# EAGLE design working (EAGLE 6.5.0)
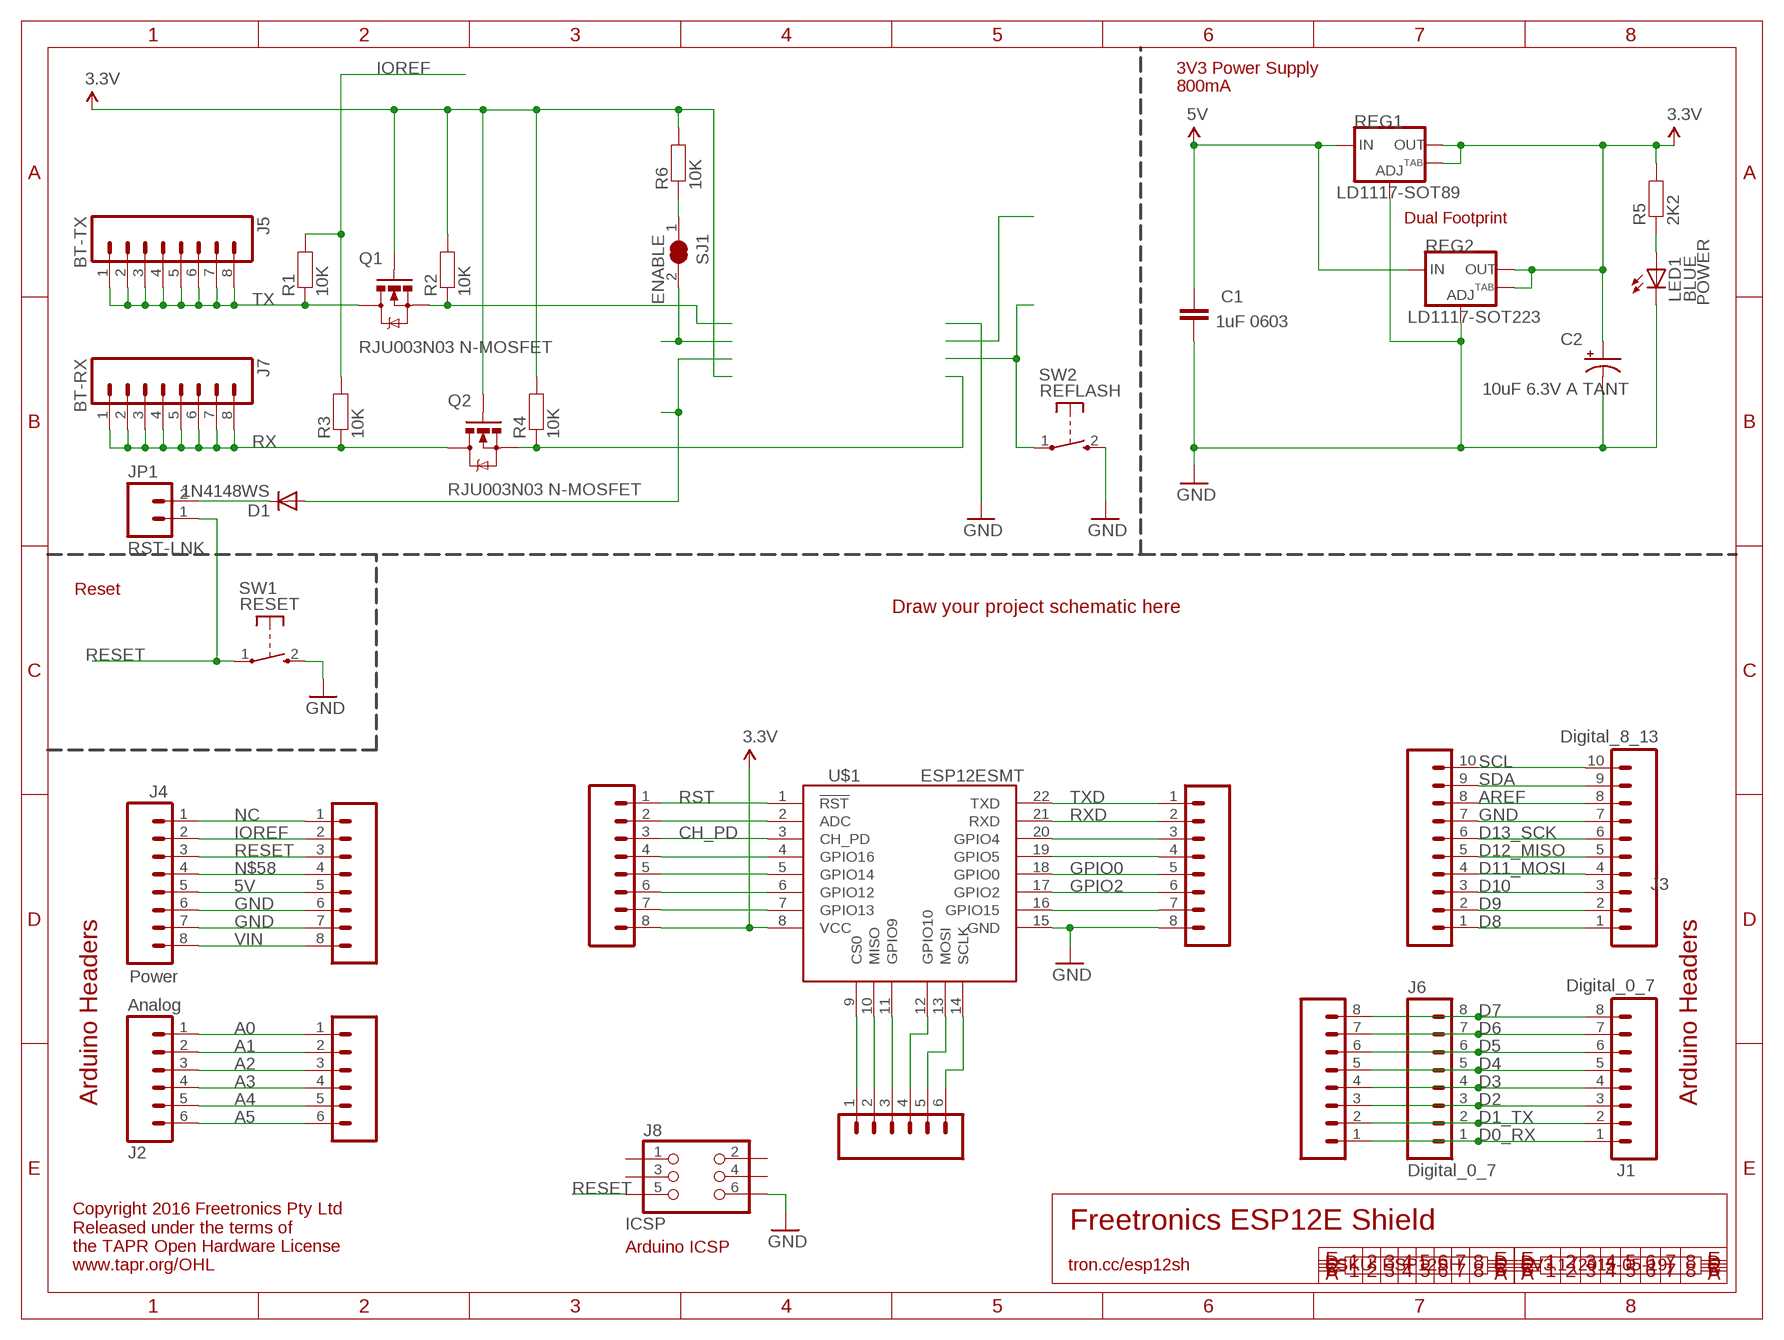
[diagram p0: schematic, sheet 1]

## Parts
C1  1uF 0603  CAP0603  [0603]
C2  10uF 6.3V A TANT  CAP_POL1206  [EIA3216]
D1  1N4148WS  DIODESOD  [SOD-323]
J1  Digital_0_7  M08  [1X08]
J2  Analog  M06SIP  [1X06]
J3  Digital_8_13  M100.1  [1X10]
J4  Power  M08  [1X08]
J5  BT-TX  M08  [1X08]
J6  Digital_0_7  M08  [1X08]
J7  BT-RX  M08  [1X08]
J8  ICSP  ICSPPTH  [2X03PTH]
JP1  RST-LNK  M02PTH  [1X02]
LED1  BLUE  LED0603  [LED-0603]
Q1  RJU003N03 N-MOSFET  MOSFET-NSOT-323  [SOT32-3]
Q2  RJU003N03 N-MOSFET  MOSFET-NSOT-323  [SOT32-3]
R1  10K  RESISTOR0603  [0603]
R2  10K  RESISTOR0603  [0603]
R3  10K  RESISTOR0603  [0603]
R4  10K  RESISTOR0603  [0603]
R5  2K2  RESISTOR0603  [0603]
R6  10K  RESISTOR0603  [0603]
REG1  LD1117-SOT89  V_REG_LM1117SOT89  [SOT89]
REG2  LD1117-SOT223  V_REG_LM1117SOT223  [SOT223]
SJ1  ENABLE  SJCN  [SJC]
SL1  Digital_0_7  M08  [1X08]
SL2  Analog  M06SIP  [1X06]
SL3  Digital_8_13  M100.1  [1X10]
SL4  Power  M08  [1X08]
SL5  5V  M08  [1X08]
SL6  5V  M08  [1X08]
SL7  Analog  M06SIP  [1X06]
SW1  RESET  TAC_SWITCH_2PIN  [TACTILE_SWITCH_SMD_2PIN_TINY]
SW2  REFLASH  TAC_SWITCH_2PIN  [TACTILE_SWITCH_SMD_2PIN_TINY]
U$1  ESP12ESMT  [ESP12E]

## Nets
3.3V: C2.A(+) Q1.1(G) Q2.1(G) R2.2 R4.2 R5.2 R6.2 REG1.2(OUT) REG1.4(OUT) REG2.2(OUT) REG2.4(OUT) SL6.8 U$1.8(VCC)
5V: C1.1 J4.5 REG1.3(IN) REG2.3(IN) SL4.5
A0: J2.1 SL2.1
A1: J2.2 SL2.2
A2: J2.3 SL2.3
A3: J2.4 SL2.4
A4: J2.5 SL2.5
A5: J2.6 SL2.6
AREF: J3.8 SL3.8
CH_PD: SJ1.2 SL6.3 U$1.3(CH_PD)
D0_RX: J1.1 J6.1 SL1.1
D1_TX: J1.2 J6.2 SL1.2
D2: J1.3 J6.3 SL1.3
D3: J1.4 J6.4 SL1.4
D4: J1.5 J6.5 SL1.5
D5: J1.6 J6.6 SL1.6
D6: J1.7 J6.7 SL1.7
D7: J1.8 J6.8 SL1.8
D8: J3.1 SL3.1
D9: J3.2 SL3.2
D10: J3.3 SL3.3
D11_MOSI: J3.4 SL3.4
D12_MISO: J3.5 SL3.5
D13_SCK: J3.6 SL3.6
GND: C1.2 C2.C(-) J3.7 J4.6 J4.7 J8.6 LED1.C REG1.1(ADJ) REG2.1(ADJ) SL3.7 SL4.6 SL4.7 SL5.8 SW1.2(S) SW2.2(S) U$1.15(GND)
GPIO0: SL5.5 SW2.1(P) U$1.18(GPIO0)
GPIO2: SL5.6 U$1.17(GPIO2)
IOREF: J4.2 R1.2 R3.2 SL4.2
N$1: SL7.1 U$1.9(CS0)
N$2: SL7.2 U$1.10(MISO)
N$3: SL7.3 U$1.11(GPIO9)
N$4: SL7.4 U$1.12(GPIO10)
N$14: LED1.A R5.1
N$15: SL7.5 U$1.13(MOSI)
N$16: SL7.6 U$1.14(SCLK)
N$18: SL5.7 U$1.16(GPIO15)
N$19: SL5.4 U$1.19(GPIO5)
N$20: SL5.3 U$1.20(GPIO4)
N$25: SL6.2 U$1.2(ADC)
N$26: SL6.4 U$1.4(GPIO16)
N$27: SL6.5 U$1.5(GPIO14)
N$28: SL6.6 U$1.6(GPIO12)
N$29: SL6.7 U$1.7(GPIO13)
N$58: J4.4 SL4.4
N$60: R6.1 SJ1.1
N$61: D1.1(C) JP1.2
NC: J4.1 SL4.1
RESET: J4.3 J8.5 JP1.1 SL4.3 SW1.1(P)
RST: D1.2(A) SL6.1 U$1.1(!RST)
RX: J7.1 J7.2 J7.3 J7.4 J7.5 J7.6 J7.7 J7.8 Q2.3(D) R3.1
RXD: Q2.2(S) R4.1 SL5.2 U$1.21(RXD)
SCL: J3.10 SL3.10
SDA: J3.9 SL3.9
TX: J5.1 J5.2 J5.3 J5.4 J5.5 J5.6 J5.7 J5.8 Q1.3(D) R1.1
TXD: Q1.2(S) R2.1 SL5.1 U$1.22(TXD)
VIN: J4.8 SL4.8
Unconnected: J8.1 J8.2 J8.3 J8.4

## Notes on the sheet
- 3V3 Power Supply
- 800mA
- Dual Footprint
- POWER
- Reset
- Draw your project schematic here
- Arduino Headers | Arduino Headers
- Freetronics ESP12E Shield
- Arduino ICSP
- Copyright 2016 Freetronics Pty Ltd
  Released under the terms of
  the TAPR Open Hardware License
  www.tapr.org/OHL
- tron.cc/esp12sh | SKU: ESP12SH | V3.1 (2015-05-19)

## Library data of the parts
C1 = freetronics:CAP: Capacitor Standard 0603 ceramic capacitor, and 0.1" leaded capacitor.
C2 = freetronics:CAP_POL: Capacitor Polarized These are standard SMD and PTH capacitors. Normally 10uF, 47uF, and 100uF in electrolytic and tantalum varieties. Always verify the external diameter of the through hole cap, it varies with capacity, voltage, and manufacturer. The EIA devices should be standard.
D1 = freetronics-original:DIODE: Diode These are standard reverse protection diodes and small signal diodes. SMA package can handle up to about 1A. SOD-323 can handle about 200mA. What the SOD-323 package when ordering, there are some mfgs out there that are 5-pin packages.
J1 J4 SL1 SL4-SL6 = freetronics:M08: Header 8 Standard 8-pin 0.1" header. Use with straight break away headers (SKU : PRT-00116), right angle break away headers (PRT-00553), swiss pins (PRT-00743), machine pins (PRT-00117), and female headers (PRT-00115).
J2 SL2 SL7 = freetronics:M06: Header 6 Standard 6-pin 0.1" header. Use with straight break away headers (SKU : PRT-00116), right angle break away headers (PRT-00553), swiss pins (PRT-00743), machine pins (PRT-00117), and female headers (PRT-00115). Molex polarized connector foot print use with SKU : PRT-08094 with associated crimp pins and housings. NOTES ON THE VARIANTS LOCK and LOCK_LONGPADS... This footprint was designed to help hold the alignment of a through-hole component (i.e. 6-pin header) while soldering it into place. You may notice that each hole has been shifted either up or down by 0.005 of an inch from it's more standard position (which is a perfectly straight line). This slight alteration caused the pins (the squares in the middle) to touch the edges of the holes. Because they are alternating, it causes a "brace" to hold the component in place. 0.005 has proven to be the perfect amount of "off-center" position when using our standard breakaway headers. Although looks a little odd when you look at the bare footprint, once you have a header in there, the alteration is very hard to notice. Also, if you push a header all the way into place, it is covered up entirely on the bottom side. This idea of altering the position of holes to aid alignment will be further integrated into the Sparkfun Library for other footprints. It can help hold any component with 3 or more connection pins.
J3 SL3 = freetronics-original:M10: Header 10 Standard 10-pin 0.1" header. Use with straight break away headers (SKU : PRT-00116), right angle break away headers (PRT-00553), swiss pins (PRT-00743), machine pins (PRT-00117), and female headers (PRT-00115).
J5-J7 = freetronics-original:M08: Header 8 Standard 8-pin 0.1" header. Use with straight break away headers (SKU : PRT-00116), right angle break away headers (PRT-00553), swiss pins (PRT-00743), machine pins (PRT-00117), and female headers (PRT-00115).
J8 = freetronics-jon:ICSP
JP1 = freetronics-original:M02: Header 2 Standard 2-pin 0.1" header. Use with straight break away headers (SKU : PRT-00116), right angle break away headers (PRT-00553), swiss pins (PRT-00743), machine pins (PRT-00117), and female headers (PRT-00115). Molex polarized connector foot print use with SKU : PRT-08233 with associated crimp pins and housings.
LED1 = freetronics-jon:LED: LEDs Standard schematic elements and footprints for 5mm, 3mm, 1206, and 0603 sized LEDs. 5mm - Spark Fun Electronics SKU : COM-00529 (and others)
Q1 Q2 = freetronics-jon:MOSFET-N: Basic N-Channel MOSFET
R1-R6 = freetronics-jon:RESISTOR: Resistor Basic schematic elements and footprints for 0603, 1206, and PTH 1/10th watt (small) resistors.
REG1 REG2 = freetronics:V_REG_LM1117: Voltage Regulator LD1117 Adjustable low-dropout voltage regulator available in SOT89 and SOT223 SMT packages.
SJ1 = freetronics-jon:SJC
SW1 SW2 = freetronics-jon:TAC_SWITCH_2PIN: Momentary Tactile Switch - 2 pin
U$1 = freetronics-jon:ESP12E

## Board
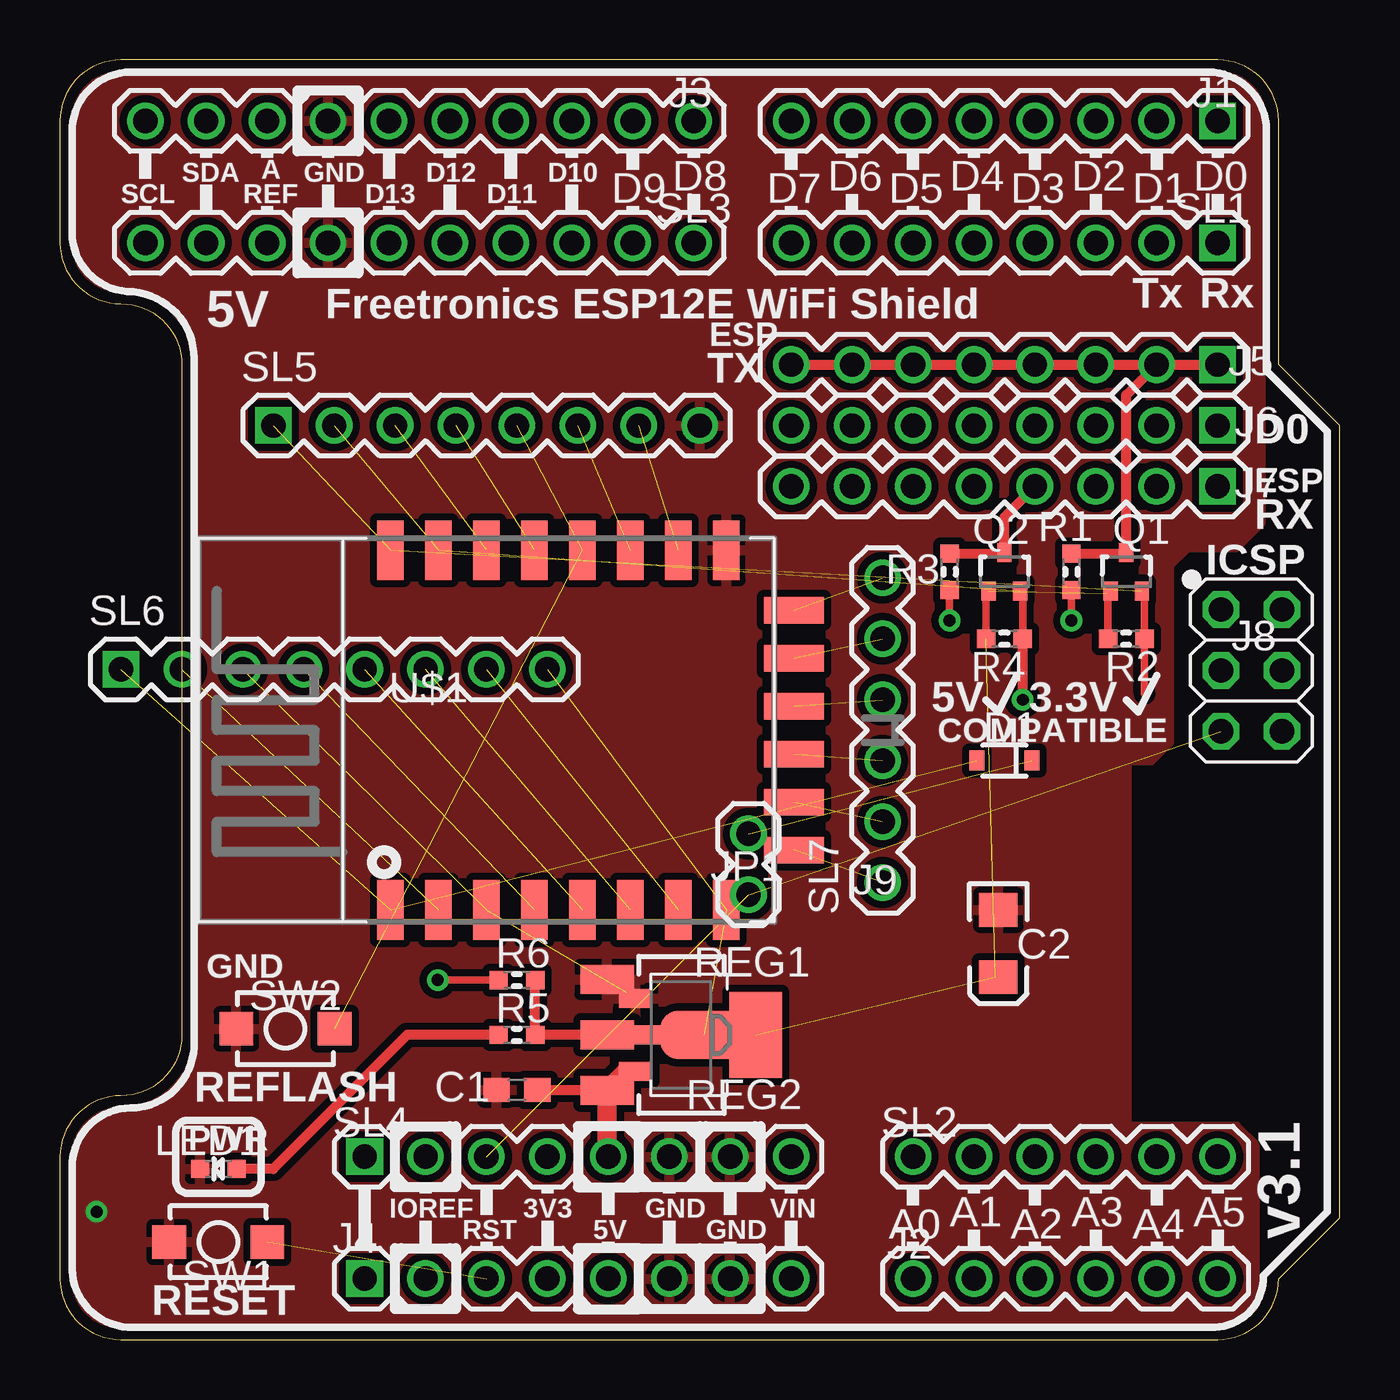
[diagram p1: board, top side]
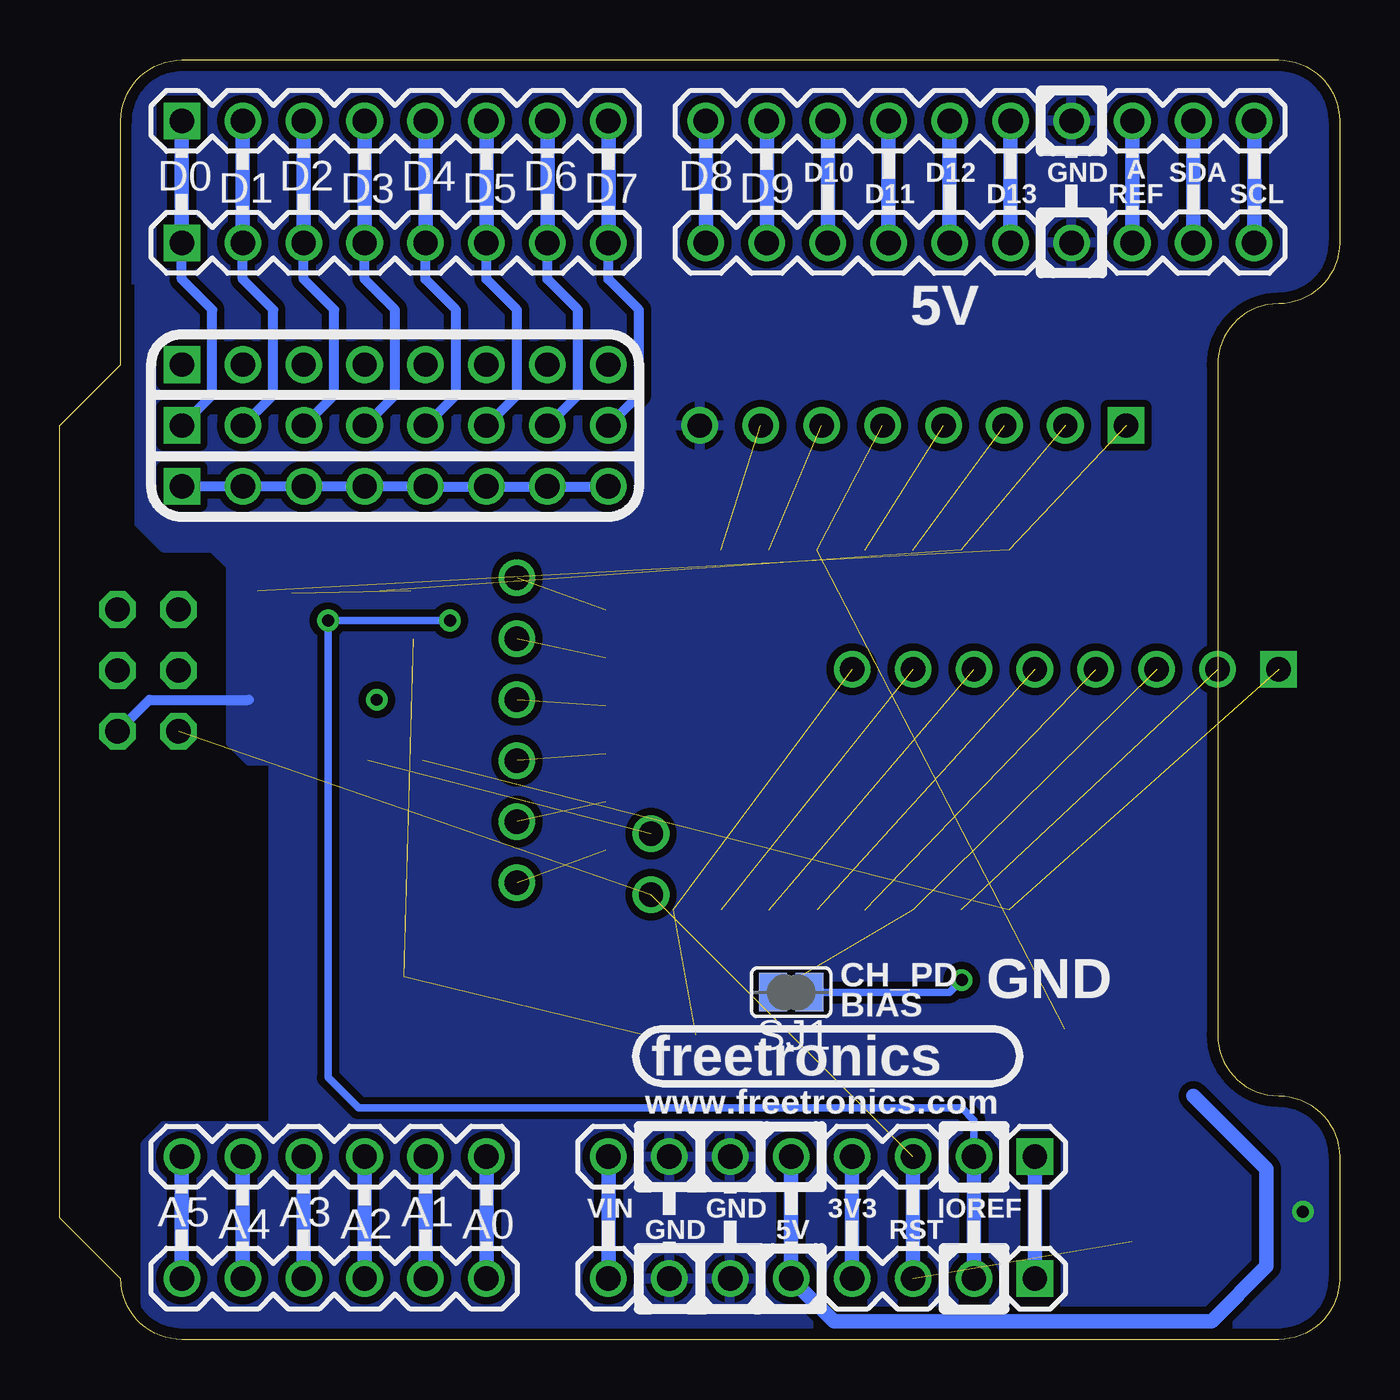
[diagram p2: board, bottom side, seen from below]

Size 53.34 x 53.34 mm. Coordinates in mm from the lower left corner, seen from the top.
Outline: 0,2.54 arc90 2.54,0 48.26,0 arc90 50.8,2.54 53.34,5.08 53.34,38.1 50.8,40.64 50.8,50.8 arc90 48.26,53.34 2.54,53.34 arc90 0,50.8 0,45.72 arc90 2.54,43.18 arc-90 5.08,40.64 5.08,12.7 arc-90 2.54,10.16 arc90 0,7.62 0,2.54
Copper layers (1*16): Top 0.035mm / dielectric 1.5mm / Bottom 0.035mm
Design rules "default *": minimum track width 10mil, minimum drill 24mil, track to track 12mil, track to pad 12mil, pad to pad 12mil, via to via 12mil, smd to smd 8mil, copper to edge 18mil, drill to drill 8mil, minimum pad ring 10mil, minimum via ring 8mil, stop-mask expansion 4mil, vias tented up to drill 20mil, thermal gap 10mil

### Footprints (pad centres in the part's own frame; a part is rotated, then mirrored left to right if it is on the bottom)
0603 = smd 1.1 x 1: 1 -0.85,0; 2 0.85,0
EIA3216 = smd 1.4 x 1.6: A 1.4,0; C -1.4,0
SOD-323 = smd 0.63 x 0.83: 1 -1.15,0; 2 1.15,0
1X08 = drill 1.016 square: 1 0,0 | drill 1.016: 2 2.54,0; 3 5.08,0; 4 7.62,0; 5 10.16,0; 6 12.7,0; 7 15.24,0; 8 17.78,0
1X06 = drill 1.016: 1 0,0; 2 2.54,0; 3 5.08,0; 4 7.62,0; 5 10.16,0; 6 12.7,0
1X10 = drill 1.016: 1 0,0; 2 2.54,0; 3 5.08,0; 4 7.62,0; 5 10.16,0; 6 12.7,0; 7 15.24,0; 8 17.78,0; 9 20.32,0; 10 22.86,0
2X03PTH = drill 1.016 octagon: 1 -2.54,-1.27; 2 -2.54,1.27; 3 0,-1.27; 4 0,1.27; 5 2.54,-1.27; 6 2.54,1.27
1X02 = drill 1.016: 1 0,0; 2 2.54,0
LED-0603 = smd 0.762 x 0.762: A -0.762,0; C 0.762,0
SOT32-3 = smd 0.6 x 0.8: 1 -0.65,-0.8; 2 0.65,-0.8; 3 0,0.8
0603' = smd 0.762 x 0.762: 1 -0.762,0; 2 0.762,0
SOT89 = smd 0.8 x 1.4: 1 -1.524,-1.905; 3 1.524,-1.905 | smd 0.8 x 1.9: 2 0,-1.651 | smd 2.032 x 3.65: 4 0,0.94
SOT223 = smd 1.219 x 2.235: 1 -2.311,-3.099; 2 0,-3.099; 3 2.311,-3.099 | smd 3.6 x 2.2: 4 0,3.099
SJC = smd 1.168 x 1.6: 1 -0.762,0; 2 0.762,0
TACTILE_SWITCH_SMD_2PIN_TINY = smd 1.4 x 1.4: 1 -2.05,0; 2 2.05,0
ESP12E = smd 1.1 x 2.5: 1 -4,-7.5; 2 -2,-7.5; 3 0,-7.5; 4 2,-7.5; 5 4,-7.5; 6 6,-7.5; 7 8,-7.5; 8 10,-7.5; 15 10,7.5; 16 8,7.5; 17 6,7.5; 18 4,7.5; 19 2,7.5; 20 0,7.5; 21 -2,7.5; 22 -4,7.5 | smd 2.5 x 1.1: 9 12.82,-5; 10 12.82,-3; 11 12.82,-1; 12 12.82,1; 13 12.82,3; 14 12.82,5

### Placement (x,y rotation side)
C1  19.05,10.41 180 top
C2  39.12,16.51 270 top
D1  39.37,24.13 180 top
J1  48.26,50.8 180 top
J2  35.56,2.54 0 top
J3  26.42,50.8 180 top
J4  12.7,2.54 0 top
J5  48.26,40.64 180 top
J6  48.26,38.1 180 top
J7  48.26,35.56 180 top
J8  49.67,27.89 270 top
JP1  28.7,18.54 90 top
LED1  6.6,7.11 180 top
Q1  44.45,32 0 top
Q2  39.37,32 0 top
R1  10K  [0603']  42.16,32 270 top
R2  10K  [0603']  44.45,29.21 180 top
R3  10K  [0603']  37.08,32 270 top
R4  10K  [0603']  39.37,29.21 180 top
R5  2K2  [0603']  19.05,12.7 0 top
R6  10K  [0603']  19.05,14.99 0 top
REG1  25.91,12.7 270 top
REG2  25.91,12.7 270 top
SJ1  22.86,14.48 180 bottom
SL1  48.26,45.72 180 top
SL2  35.56,7.62 0 top
SL3  26.42,45.72 180 top
SL4  12.7,7.62 0 top
SL5  8.89,38.1 0 top
SL6  2.54,27.94 0 top
SL7  34.29,19.05 90 top
SW1  6.6,4.06 180 top
SW2  9.4,12.95 180 top
U$1  17.78,25.4 0 top

### Tracks (layer width: path | path; a pad name or v marks a point on that pad's centre or on a via)
3.3V  (5 unrouted)
  Top 0.254: 43.69,31.09 Q1.1 | 38.61,31.09 Q2.1
  Top 0.305: R2.2 43.69,31.09 | R4.2 38.61,31.09
  Top 0.406: C2.A 38.99,15.11 | REG1.2 R5.2 R6.2
  Top 0.813: REG2.2 REG1.2 REG1.4 REG2.4
5V
  Top 0.406: C1.1 22.78,10.41 REG2.3
  Top 0.813: REG1.3 23.6,11.18 REG2.3 22.81,7.67 SL4.5
  Bottom 0.61: SL4.5 J4.5 21.08,0.76 5.33,0.76 3.05,3.05 3.05,7.11 6.1,10.16
A0
  Bottom 0.61: J2.1 SL2.1
A1
  Bottom 0.61: J2.2 SL2.2
A2
  Bottom 0.61: J2.3 SL2.3
A3
  Bottom 0.61: J2.4 SL2.4
A4
  Bottom 0.61: J2.5 SL2.5
A5
  Bottom 0.61: J2.6 SL2.6
AREF
  Bottom 0.61: SL3.8 J3.8
CH_PD  (2 unrouted)
D0_RX
  Bottom 0.406: J6.1 46.99,39.37 46.99,42.93 48.26,44.2 SL1.1
  Bottom 0.61: SL1.1 J1.1
D1_TX
  Bottom 0.406: J6.2 44.45,39.37 44.45,42.93 45.72,44.2 SL1.2
  Bottom 0.61: SL1.2 J1.2
D2
  Bottom 0.406: J6.3 41.91,39.37 41.91,42.93 43.18,44.2 SL1.3
  Bottom 0.61: SL1.3 J1.3
D3
  Bottom 0.406: J6.4 39.37,39.37 39.37,42.93 40.64,44.2 SL1.4
  Bottom 0.61: SL1.4 J1.4
D4
  Bottom 0.406: J6.5 36.83,39.37 36.83,42.93 38.1,44.2 SL1.5
  Bottom 0.61: SL1.5 J1.5
D5
  Bottom 0.406: J6.6 34.29,39.37 34.29,42.93 35.56,44.2 SL1.6
  Bottom 0.61: SL1.6 J1.6
D6
  Bottom 0.406: J6.7 31.75,39.37 31.75,42.93 33.02,44.2 SL1.7
  Bottom 0.61: SL1.7 J1.7
D7
  Bottom 0.406: J6.8 29.21,39.37 29.21,42.93 30.48,44.2 SL1.8
  Bottom 0.61: SL1.8 J1.8
D8
  Bottom 0.61: SL3.1 J3.1
D9
  Bottom 0.61: SL3.2 J3.2
D10
  Bottom 0.61: SL3.3 J3.3
D11_MOSI
  Bottom 0.61: SL3.4 J3.4
D12_MISO
  Bottom 0.61: SL3.5 J3.5
D13_SCK
  Bottom 0.61: SL3.6 J3.6
GND  (via drill 0.5)
  Bottom 0.406: J8.6 49.62,26.67 45.47,26.67
  other vias: 1.52,5.33
  pour Bottom: 0,50.8 arc-74 2.54,53.34 48.26,53.34 arc-74 50.8,50.8 50.8,44.2 50.04,44.2 50.04,34.04 49.02,33.02 46.99,33.02 46.23,32.26 46.23,24.89 45.47,24.13 44.45,24.13 44.45,8.89 49.02,8.89 49.78,8.13 49.78,1.52 arc-74 48.26,0 2.54,0 arc-74 0,2.54 0,7.62 arc-90 2.54,10.16 arc90 5.08,12.7 5.08,40.64 arc90 2.54,43.18 arc-90 0,45.72
  pour Top: 0,50.8 arc-74 2.54,53.34 48.26,53.34 arc-74 50.8,50.8 50.8,44.2 50.04,44.2 50.04,34.04 49.02,33.02 46.99,33.02 46.23,32.26 46.23,24.89 45.47,24.13 44.45,24.13 44.45,8.89 49.02,8.89 49.78,8.13 49.78,1.52 arc-74 48.26,0 2.54,0 arc-74 0,2.54 0,7.62 arc-90 2.54,10.16 arc90 5.08,12.7 5.08,40.64 arc90 2.54,43.18 arc-90 0,45.72
GPIO0  (2 unrouted)
  Top 0.254: SW2.1 11.43,12.95
GPIO2  (1 unrouted)
IOREF  (via drill 0.5)
  Top 0.305: R3.2 v37.08,29.97 | v42.16,29.97 R1.2
  Bottom 0.305: v37.08,29.97 v42.16,29.97 42.16,10.92 40.89,9.65 15.75,9.65 15.24,9.14 SL4.2
  Bottom 0.61: J4.2 SL4.2
N$1  (1 unrouted)
N$2  (1 unrouted)
N$3  (1 unrouted)
N$4  (1 unrouted)
N$5  (via drill 1.02)
  other vias: 77.47,33.02
N$6  (via drill 1.02)
  other vias: 74.93,33.02
N$7  (via drill 1.02)
  other vias: 77.47,35.56
N$8  (via drill 1.02)
  other vias: 74.93,35.56
N$9  (via drill 1.02)
  other vias: 77.47,38.1
N$10  (via drill 1.02)
  other vias: 74.93,38.1
N$11  (via drill 1.02)
  other vias: 72.39,33.02
N$12  (via drill 1.02)
  other vias: 72.39,48.26
N$13  (via drill 1.02)
  other vias: 69.85,48.26
N$14
  Top 0.406: R5.1 14.48,12.7 8.89,7.11 LED1.A
N$15  (1 unrouted)
N$16  (1 unrouted)
N$17  (via drill 1.02)
  other vias: 69.85,33.02
N$18  (1 unrouted)
N$19  (1 unrouted)
N$20  (1 unrouted)
N$21  (via drill 1.02)
  other vias: 72.39,35.56
N$22  (via drill 1.02)
  other vias: 69.85,35.56
N$23  (via drill 1.02)
  other vias: 72.39,38.1
N$24  (via drill 1.02)
  other vias: 69.85,38.1
N$25  (1 unrouted)
N$26  (1 unrouted)
N$27  (1 unrouted)
N$28  (1 unrouted)
N$29  (1 unrouted)
N$50  (via drill 1.02)
  other vias: 77.47,30.48
N$51  (via drill 1.02)
  other vias: 74.93,30.48
N$52  (via drill 1.02)
  other vias: 72.39,30.48
N$53  (via drill 1.02)
  other vias: 69.85,30.48
N$58
  Bottom 0.61: SL4.4 J4.4
N$60  (via drill 0.5)
  Top 0.305: v15.75,14.99 R6.1
  Bottom 0.305: SJ1.1 16.26,14.48 v15.75,14.99
N$61  (1 unrouted)
N$90  (via drill 1.02)
  other vias: 77.47,40.64
N$91  (via drill 1.02)
  other vias: 74.93,40.64
N$106  (via drill 1.02)
  other vias: 77.47,43.18
N$107  (via drill 1.02)
  other vias: 74.93,43.18
N$122  (via drill 1.02)
  other vias: 77.47,45.72
N$123  (via drill 1.02)
  other vias: 74.93,45.72
N$138  (via drill 1.02)
  other vias: 77.47,48.26
N$139  (via drill 1.02)
  other vias: 74.93,48.26
N$140  (via drill 1.02)
  other vias: 72.39,40.64
N$141  (via drill 1.02)
  other vias: 69.85,40.64
N$156  (via drill 1.02)
  other vias: 72.39,43.18
N$157  (via drill 1.02)
  other vias: 69.85,43.18
N$172  (via drill 1.02)
  other vias: 72.39,45.72
N$173  (via drill 1.02)
  other vias: 69.85,45.72
NC
  Bottom 0.61: J4.1 SL4.1
RESET  (3 unrouted)
  Bottom 0.61: J4.3 SL4.3
RST  (2 unrouted)
RX
  Top 0.254: 39.33,32.77 Q2.3
  Top 0.406: R3.1 39.33,32.77 | Q2.3 39.37,34.29 J7.4
  Bottom 0.406: J7.1 J7.2 J7.3 J7.4 J7.5 J7.6 J7.7 J7.8
RXD  (via drill 0.5)  (2 unrouted)
  Top 0.254: 40.13,31.09 Q2.2
  Top 0.305: R4.1 40.13,31.09
  Top 0.406: v40.13,26.67 R4.1
SCL
  Bottom 0.61: J3.10 SL3.10
SDA
  Bottom 0.61: J3.9 SL3.9
TX
  Top 0.254: 44.45,32.77 Q1.3
  Top 0.406: J5.8 J5.7 J5.6 J5.5 J5.4 J5.3 J5.2 | J5.2 J5.1 | R1.1 44.45,32.77 | Q1.3 44.45,39.37 J5.2
TXD  (2 unrouted)
  Top 0.254: 45.21,31.09 Q1.2
  Top 0.305: 45.21,31.09 R2.1 45.21,26.92
VIN
  Bottom 0.61: SL4.8 J4.8

### Text on the board
tPlace: SDA | A | GND | D12 | D10 | D8 | D6 | D4 | D2 | D0 | SCL | REF | D13 | D11 | D9 | D7 | D5 | D3 | D1 | Freetronics ESP12E WiFi Shield | Tx | Rx | 5V | ESP | TX | D0 | ESP | RX | ICSP | 5V | 3.3V | COMPATIBLE | tron.cc/esp1sh | RST-LNK | GND | REFLASH | PWR | IOREF | 3V3 | GND | VIN | A1 | A3 | A5 | RST | 5V | GND | A0 | A2 | A4 | v3.1 | RESET
bPlace: (c) 2015 Freetronics Pty Ltd / Released under the TAPR / Open Hardware License / www.tapr.org/OHL | CH_PD biased HIGH by default / GPIO0 pulled LOW by REFLASH | SDA | A | GND | D12 | D10 | D8 | D6 | D4 | D2 | D0 | SCL | REF | D13 | D11 | D9 | D7 | D5 | D3 | D1 | 5V | CH_PD | GND | CH_PD / BIAS | freetronics | www.freetronics.com | IOREF | 3V3 | GND | VIN | A1 | A3 | A5 | RST | 5V | GND | A0 | A2 | A4
tNames: J9 | SW2 | SW1
tValues: HC-05
Document: 1 x 2K2 0603 / 5 x 10K 0603 / 1 x 1uF 0603 / 1 x 10uF 6.3V TANT / 1 x BLUE LED 0603 / 2 x RJU003N03 / 1 x LD1117 / 1 x 1N4148WS diode / 2 x SMT TACT BUTTON
tDocu: K | K | A | A | K | A